# EAGLE design LED_5 (EAGLE 9.6.2)
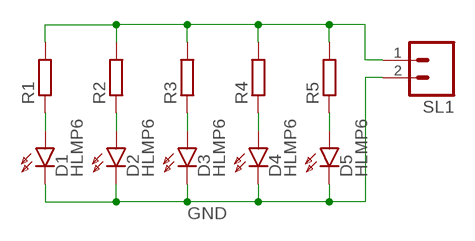
[diagram p0: schematic, sheet 1]

## Parts
D1  HLMP6  [HLMP6]
D2  HLMP6  [HLMP6]
D3  HLMP6  [HLMP6]
D4  HLMP6  [HLMP6]
D5  HLMP6  [HLMP6]
R1  R-EU_0204/7  [0204/7]
R2  R-EU_0204/7  [0204/7]
R3  R-EU_0204/7  [0204/7]
R4  R-EU_0204/7  [0204/7]
R5  R-EU_0204/7  [0204/7]
SL1  M02  [02P]

## Nets
GND: D1.K D2.K D3.K D4.K D5.K SL1.2
N$3: D3.A D4.A D5.A R1.2 R2.2 R3.1 R3.2 R4.1 R4.2 R5.1 R5.2 SL1.1
N$5: D1.A R1.1
N$7: D2.A R2.1

## Library data of the parts
D1-D5 = display-hp:HLMP6: LED 2mm horizontal; MF: AGILENT TECHNOLOGIES; MPN: HLMP-6500; OC_FARNELL: 1652490; OC_NEWARK: 40K0088
R1-R5 = rcl:R-EU_: RESISTOR, European symbol; SPICEPREFIX: R
SL1 = con-amp-quick:M02: AMP QUICK CONNECTOR; OC_FARNELL: unknown; OC_NEWARK: unknown

## Board
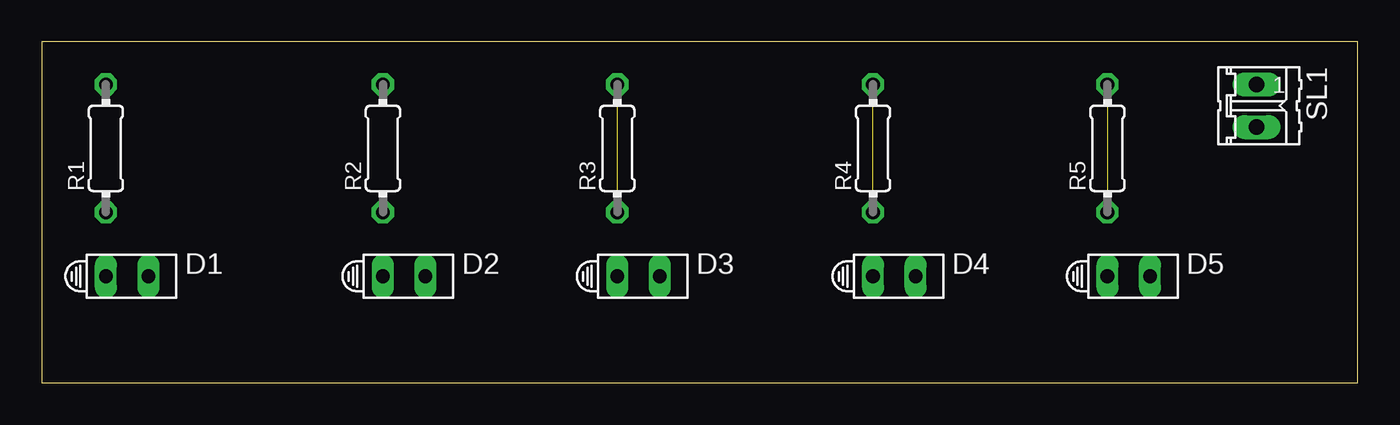
[diagram p1: board, top side]
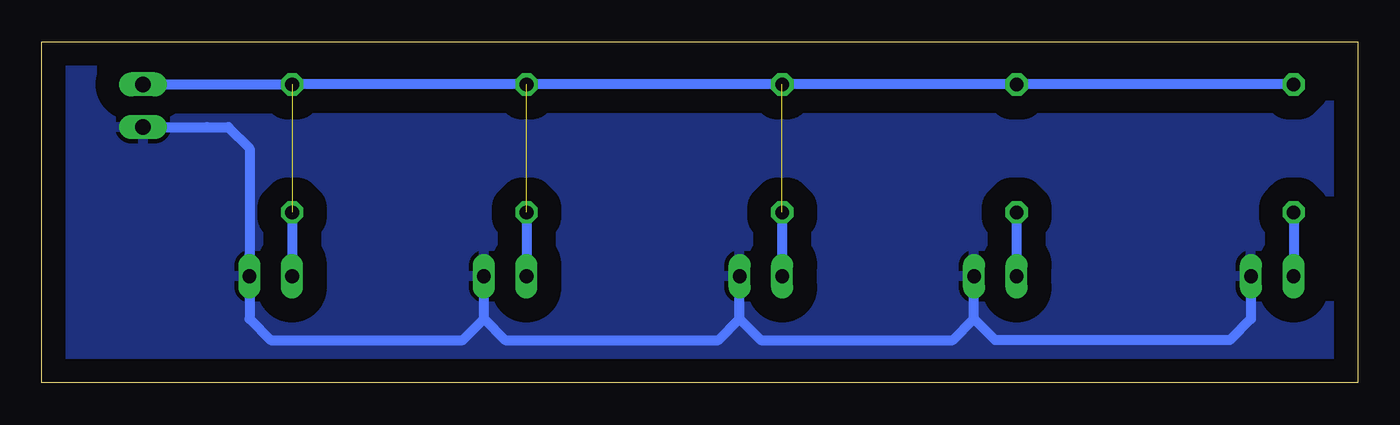
[diagram p2: board, bottom side, seen from below]

Size 78.41 x 20.31 mm. Coordinates in mm from the lower left corner, seen from the top.
Outline: 0,0 78.41,0 78.41,20.31 0,20.31 0,0
Copper layers (1*16): Top 0.035mm / dielectric 1.5mm / Bottom 0.035mm
Design rules "default": minimum track width 6mil, minimum drill 0.35mm, track to track 6mil, track to pad 6mil, pad to pad 6mil, via to via 6mil, smd to smd 6mil, copper to edge 40mil, drill to drill 6mil, minimum pad ring 10mil, minimum via ring 8mil, stop-mask expansion 4mil, vias tented up to drill 0mil, thermal gap 10mil

### Footprints (pad centres in the part's own frame; a part is rotated, then mirrored left to right if it is on the bottom)
HLMP6 = drill 0.813 long: A -1.27,0; K 1.27,0
0204/7 = drill 0.813 octagon: 1 -3.81,0; 2 3.81,0
02P = drill 0.914 long: 1 -1.27,0; 2 1.27,0

### Placement (x,y rotation side)
D1  5.08,6.35 0 top
D2  21.59,6.35 0 top
D3  35.56,6.35 0 top
D4  50.8,6.35 0 top
D5  64.77,6.35 0 top
R1  3.81,13.97 90 top
R2  20.32,13.97 90 top
R3  34.29,13.97 90 top
R4  49.53,13.97 90 top
R5  63.5,13.97 90 top
SL1  72.39,16.51 270 top

### Tracks (layer width: path | path; a pad name or v marks a point on that pad's centre or on a via)
GND
  Bottom 0.61: D1.K 6.35,3.81 7.62,2.54 21.59,2.54 22.86,3.81 | 36.83,3.81 35.56,2.54 24.13,2.54 22.86,3.81 | 22.86,3.81 D2.K | 52.07,3.81 50.8,2.54 38.1,2.54 36.83,3.81 | 36.83,3.81 D3.K | D5.K 66.04,3.81 64.77,2.54 53.34,2.54 52.07,3.81 | 52.07,3.81 D4.K | SL1.2 68.58,15.24 67.31,15.24 66.04,13.97 66.04,7.62
  pour Bottom (isolate 1.422): 0,20.32 78.74,20.32 78.74,0 0,0
N$3  (3 unrouted)
  Bottom 0.61: R3.1 D3.A | R4.1 D4.A | R5.1 D5.A | R1.2 R2.2 R3.2 R4.2 R5.2 SL1.1
N$5
  Bottom 0.61: R1.1 D1.A
N$7
  Bottom 0.61: R2.1 D2.A